# Altium schematic sheet VE_Test_MEA_REF.SchDoc
size A3
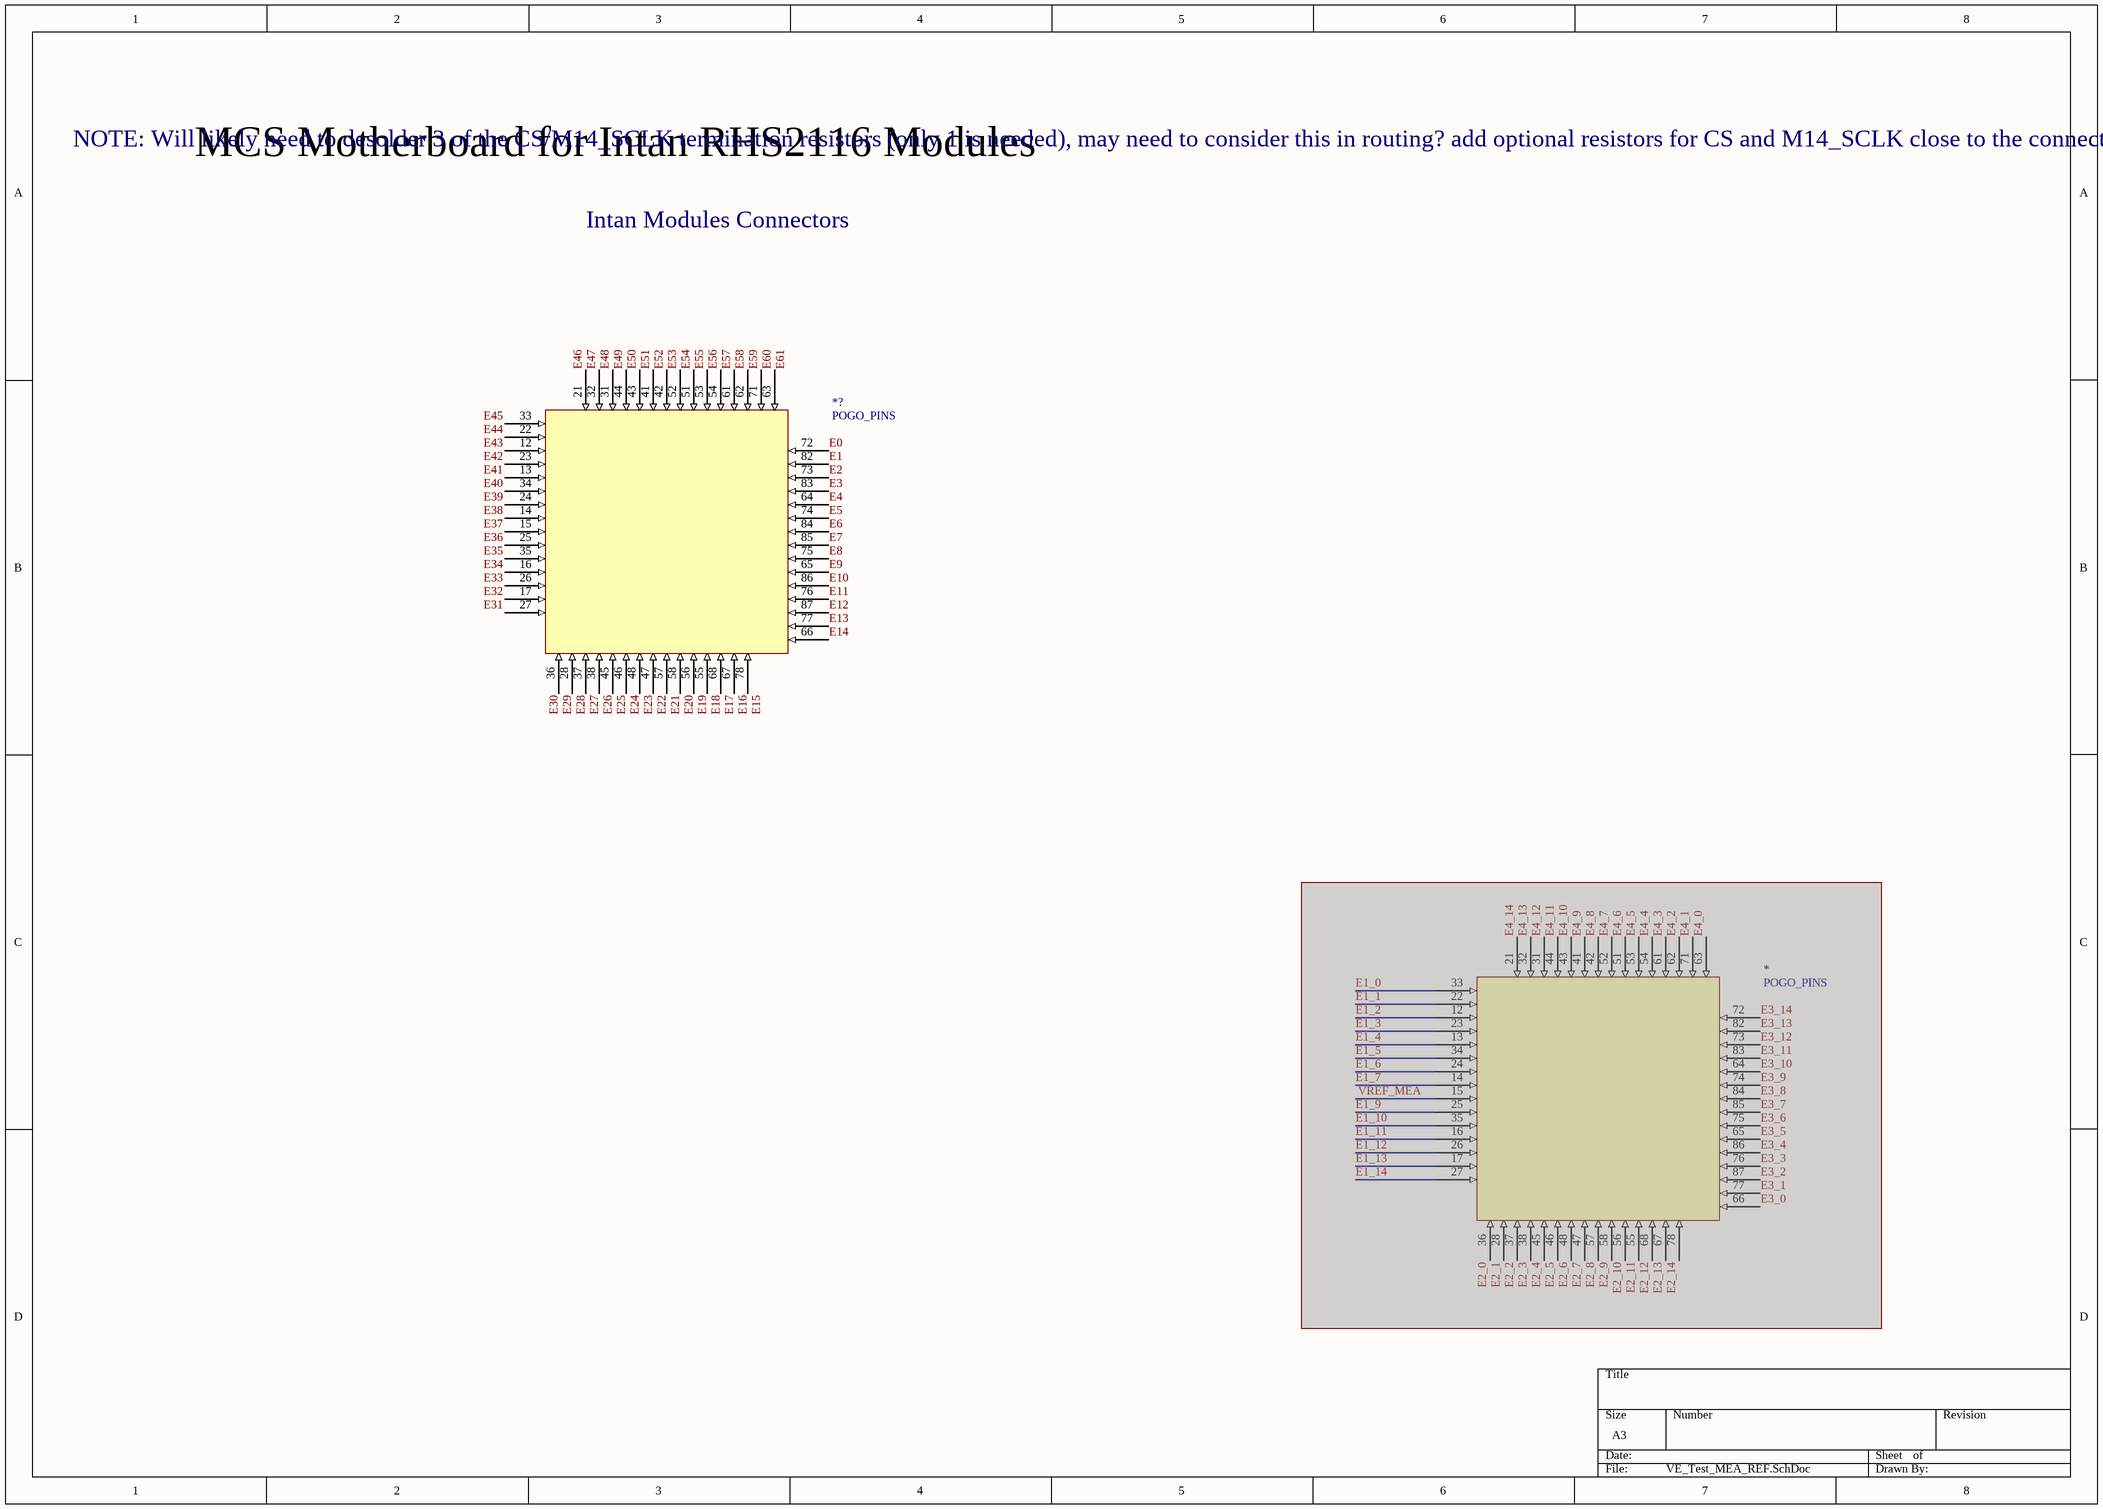
[diagram p0: VE_Test_MEA_REF.SchDoc]

## Parts
*  POGO_PINS  [POGO_PINS]  (masked out: inside a compile mask, not in the netlist)
*?  POGO_PINS  [MCS_MEA_VE_TEST_3MM]

## Nets
E0: *?.72
E1: *?.82
E2: *?.73
E3: *?.83
E4: *?.64
E5: *?.74
E6: *?.84
E7: *?.85
E8: *?.75
E9: *?.65
E10: *?.86
E11: *?.76
E12: *?.87
E13: *?.77
E14: *?.66
E15: *?.78
E16: *?.67
E17: *?.68
E18: *?.55
E19: *?.56
E20: *?.58
E21: *?.57
E22: *?.47
E23: *?.48
E24: *?.46
E25: *?.45
E26: *?.38
E27: *?.37
E28: *?.28
E29: *?.36
E31: *?.27
E32: *?.17
E33: *?.26
E34: *?.16
E35: *?.35
E36: *?.25
E37: *?.15
E38: *?.14
E39: *?.24
E40: *?.34
E41: *?.13
E42: *?.23
E43: *?.12
E44: *?.22
E45: *?.33
E46: *?.21
E47: *?.32
E48: *?.31
E49: *?.44
E50: *?.43
E51: *?.41
E52: *?.42
E53: *?.52
E54: *?.51
E55: *?.53
E56: *?.54
E57: *?.61
E58: *?.62
E59: *?.71
E60: *?.63

## Notes on the sheet
- NOTE: Will likely need to desolder 3 of the CS/M14_SCLK termination resistors (only 1 is needed), may need to consider this in routing? add optional resistors for CS and M14_SCLK close to the connector?
- MCS Motherboard for Intan RHS2116 Modules
- Intan Modules Connectors
- Labels drawn without touching a wire or pin: E30, E61